# Altium schematic sheet PowerManagement.SchDoc
size A4; Author: Ben Bowden, Jesse Mocilac, Tayla Bender, Rothon Browne; CompanyName: James Cook University; DrawnBy1: Ben Bowden, Jesse Mocilac, Tayla Bender, Rothon Browne; Organization: James Cook University; Title1: CC3501 Baby Monitor; SheetNumber: 2; SheetTotal: 4; ProjectName: *ProjectName
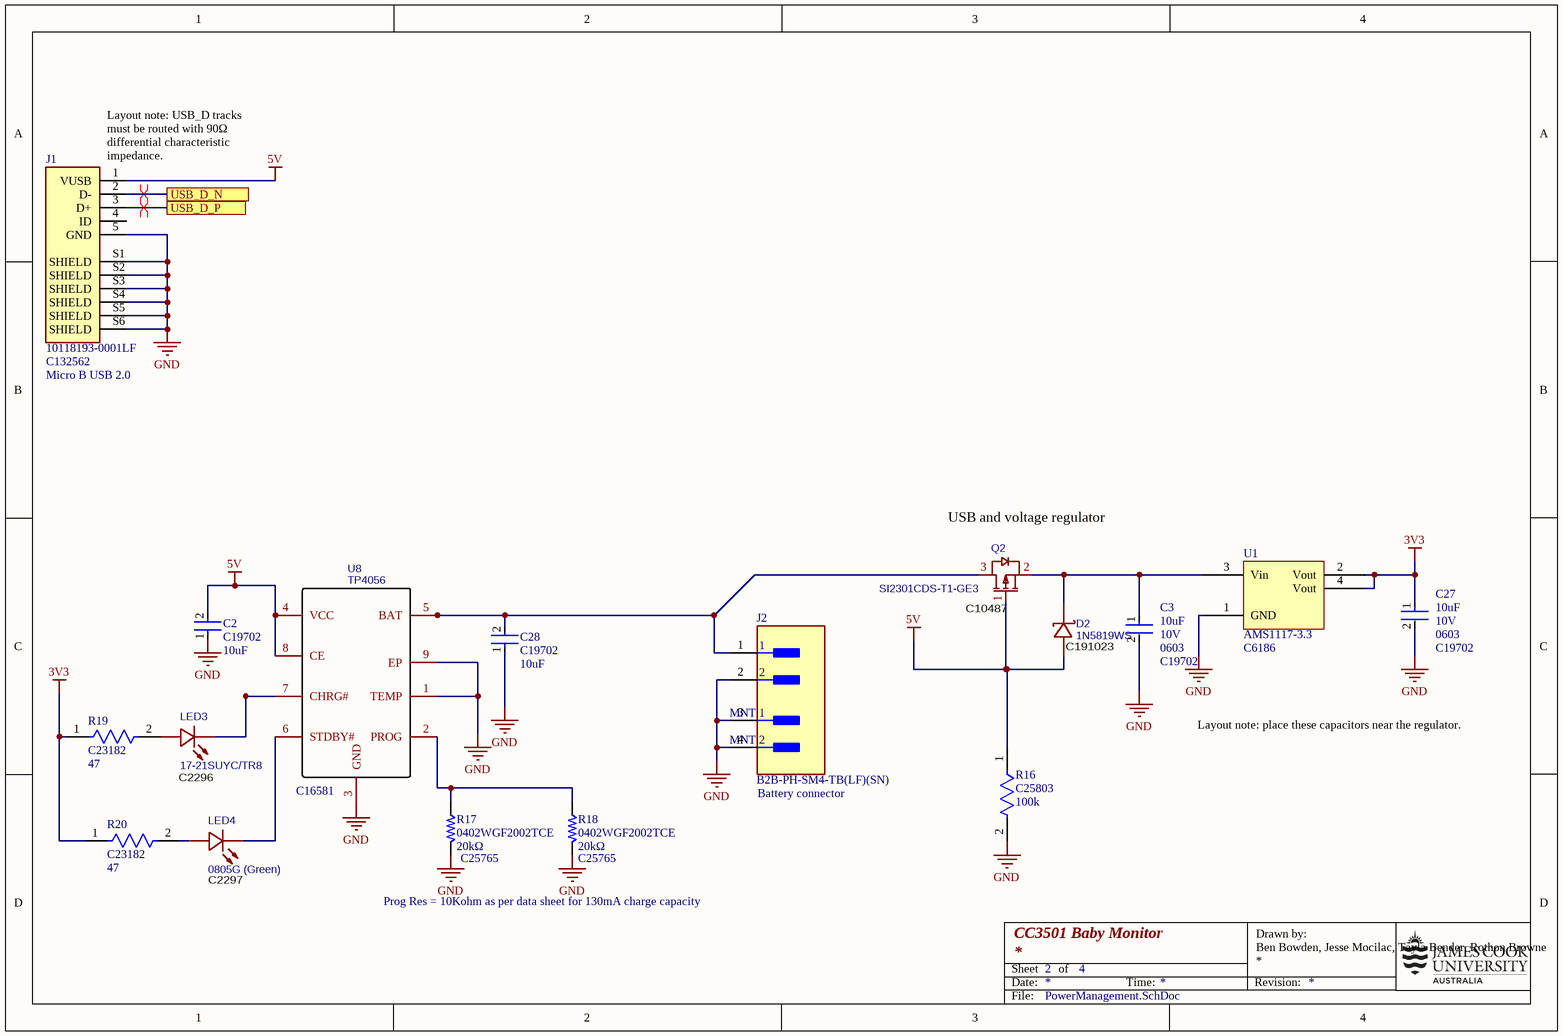
[diagram p0: PowerManagement.SchDoc]

## Parts
C2  JLCPCB Part: C19702  Capacitance: 10uF  [FP-CL10-IPC_B]  (hidden comment: CL10A106KP8NNNC)
C3  Voltage Rating: 10V  Case Code (Imperial): 0603  JLCPCB Part: C19702  Capacitance: 10uF  [FP-CL10-IPC_B]  (hidden comment: CL10A106KP8NNNC)
C27  Voltage Rating: 10V  Case Code (Imperial): 0603  JLCPCB Part: C19702  Capacitance: 10uF  [FP-CL10-IPC_B]  (hidden comment: CL10A106KP8NNNC)
C28  JLCPCB Part: C19702  Capacitance: 10uF  [FP-CL10-IPC_B]  (hidden comment: CL10A106KP8NNNC)
D2  1N5819WS  Supplier Part: C191023  [SOD-323_L1.8-W1.3-LS2.5-RD]
J1  10118193-0001LF  JLCPCB Part: C132562  [FCI_10118193-0001LF]
J2  B2B-PH-SM4-TB(LF)(SN)  [FP-B2B-PH-SM4-TB_LF_SN-MFG]
LED3  17-21SUYC/TR8  Supplier Part: C2296  [LED0805-R-RD]
LED4  0805G (Green)  Supplier Part: C2297  [LED0805-R-RD]
Q2  SI2301CDS-T1-GE3  Supplier Part: C10487  [SOT-23-3_L3.0-W1.7-P0.95-LS2.9-BR]
R16  JLCPCB Part: C25803  Resistance: 100k  [FP-CRCW0603-e3-IPC_B]  (hidden comment: 0603WAF1003T5E)
R17  0402WGF2002TCE  Resistance: 20kΩ  JLCPCB Part Number: C25765  [RES-0402]
R18  0402WGF2002TCE  Resistance: 20kΩ  JLCPCB Part Number: C25765  [RES-0402]
R19  JLCPCB Part: C23182  Resistance: 47  [FP-CRCW0603-e3-IPC_B]  (hidden comment: 0603WAF1003T5E)
R20  JLCPCB Part: C23182  Resistance: 47  [FP-CRCW0603-e3-IPC_B]  (hidden comment: 0603WAF1003T5E)
U1  AMS1117-3.3  JLCPCB Part: C6186  [SOT230P700X180-4N]
U8  TP4056  JLCPCB Part: C16581  [ESOP-8_L4.9-W3.9-P1.27-LS6.0-BL-EP]

## Ports
USB_D_N, USB_D_P

## Nets
3V3: C27.1 R19.1 R20.1 U1.2(Vout) U1.4(Vout)
5V: C2.2 D2.2(A) J1.1(VUSB) Q2.1(G) R16.1 U8.4(VCC) U8.8(CE)
GND: C2.1 C3.2 C27.2 C28.1 J1.5(GND) J1.S1(SHIELD) J1.S2(SHIELD) J1.S3(SHIELD) J1.S4(SHIELD) J1.S5(SHIELD) J1.S6(SHIELD) J2.2 J2.3(MNT_1) J2.4(MNT_2) R16.2 R17.2 R18.2 U1.1(GND) U8.1(TEMP) U8.3(GND) U8.9(EP)
USB_D_N: J1.2(D-) ; port USB_D_N
USB_D_P: J1.3(D+) ; port USB_D_P
NetC3_1: C3.1 D2.1(K) Q2.2(S) U1.3(Vin)
NetC28_2: C28.2 J2.1 Q2.3(D) U8.5(BAT)
NetLED3_1: LED3.1(+) R19.2
NetLED3_2: LED3.2(-) U8.7(CHRG#)
NetLED4_1: LED4.1(A) R20.2
NetLED4_2: LED4.2(K) U8.6(STDBY#)
NetR17_1: R17.1 R18.1 U8.2(PROG)

Not connected (* = marked no-connect by the designer): J1 4(ID)

## Layout directives
differential pair: USB_D_N, USB_D_P

## Notes on the sheet
- (near J1) Layout note: USB_D tracks must be routed with 90Ω differential characteristic impedance.
- (near J1) Micro B USB 2.0
- (near Q2) USB and voltage regulator
- Layout note: place these capacitors near the regulator.
- (near J2) Battery connector
- Prog Res = 10Kohm as per data sheet for 130mA charge capacity
- Date:
- Sheet
- of
- Time:
- Revision:
- Drawn by:
- File:

## Library data of the parts
C2 C3 C27 C28 = CMP-00006-4: Cap Ceramic 10uF 10V X5R ±10% Pad SMD 0603 +85°C T/R; Case Code (Metric): 1608; Packaging: Tape and Reel; Case/Package: 0603; Mount: Surface Mount; Max Operating Temperature: 85°C; Width: 0.031inch; Length: 0.063inch; Thickness: 0.041inch; Tolerance: 10%; Min Operating Temperature: -55°C
  C2 C28: Voltage Rating: 10V; Case Code (Imperial): 0603
D2 = 1N5819WS: Manufacturer: Hottech(合科泰); Contributor: LCSC; Supplier: LCSC; Manufacturer Part: 1N5819WS; JLCPCB Part Class: Basic Part; spicePre: D; spiceSymbolName: 1N5819WS
J1 = CMP-045-000000-7: USB - micro B USB 2.0 Receptacle Connector 5 Position Surface Mount, Right Angle; Through Hole; MF: Amphenol ICC; Pin Count: 11; Package: None; MP: 10118193-0001LF; SnapEDA_Link: https://www.snapeda.com/parts/10118193-0001LF/Amphenol%20FCI/view-part/2758989/?ref=snap; Design Item ID: 10118193-0001LF; Source: SnapEDAsch.SchLib; Component Type: Standard
J2 = CMP-2000-05163-2: CONN HEADER SMD 2POS 2MM; Number of Poles: 2; Max Current Rating: 2A; Gender: Male; Working Voltage: 100V; Mated Stacking Heights: 8.6mm; Contact Resistance: 20mR; Insulation Resistance: 1GR; Number of Contacts: 2; Housing Material: Polyamide; Lead Pitch: 2mm; Packaging: Tape and Reel; Fastening Type: Detent; Contact Finish - Mating: TIN; Width: 5.5mm; Min Operating Temperature: -25°C; Mount: Surface Mount; Current Rating: 2A; Pitch: 2mm; REACH SVHC: No SVHC; Flammability Rating: UL94 V-0; Contact Plating: Tin; Voltage Rating (AC): 100V; Length: 7.95mm; Number of Rows: 1; Max Operating Temperature: 85°C; Connector Type: Header; Height: 9.4mm; Insulation Material: Nylon; Depth: 5mm; Color: White; Termination: Solder; Housing Color: Beige; Contact Mating Length: 0.13inch; Contact Material: Copper Alloy; Orientation: Straight; Contact Type: Male Pin; Lead Free: Lead Free; Voltage Rating: 100V; Series: PH; Number of Positions: 2; Contact Shape: Square; Max Voltage Rating (AC): 100V; Insulation Color: Natural
LED3 = 17-21SUYC/TR8: Manufacturer: KENTO; Manufacturer Part: KT-0805黄灯; Supplier: LCSC; JLCPCB Part Class: Basic Part; spicePre: L; spiceSymbolName: 17-21SUYC/TR8
LED4 = 0805G (Green): Manufacturer: KENTO; Manufacturer Part: KT-0805G; Supplier: LCSC; JLCPCB Part Class: Basic Part; spicePre: L; spiceSymbolName: 0805G (Green)
Q2 = SI2301CDS-T1-GE3: Manufacturer: VISHAY(威世); Supplier: LCSC; Manufacturer Part: SI2301CDS-T1-GE3; JLCPCB Part Class: Basic Part; spicePre: Q; spiceSymbolName: SI2301CDS-T1-GE3
R16 = CMP-009-0004-3: RES Thick Film, 100kΩ, 1%, 0.1W, 100ppm/°C, 0603; Power Rating: 100mW; Voltage Rating: 75V; Mount: Surface Mount; Number of Pins: 2; Depth: 0.85mm; Case/Package: 0603; Composition: Thick Film; Max Operating Temperature: 155°C; Case Code (Metric): 1608; Contact Plating: Tin; Temperature Coefficient: 100ppm/°C; Weight: 7.1E-05oz; Height: 0.45mm; Termination: SMD/SMT; Tolerance: 1%; Min Operating Temperature: -55°C; Lead Free: Lead Free; Voltage Rating (DC): 75V; Case Code (Imperial): 0603; Length: 1.55mm; Packaging: Tape and Reel; Package Quantity: 5000; Radiation Hardening: No; Width: 0.85mm; Military Standard: Not
R17 R18 = CMP-009-00024-1: Resistor, 20kΩ, ±1%, 62.5mW, 50V, ±100ppm/℃, -55℃~+155℃, SMD 0402; Manufacturer: Uniroyal; ComponentLink2Description: JLCPCB Part URL; Tolerance: ±1%; JLCPCB Basic Part: Yes; ComponentLink1Description: Datasheet; Temperature Rating: -55℃~+155℃; Voltage Rating: 50V; Design Item ID: 0402WGF2002TCE; Category: Resistors; Package Size: 0402; ComponentLink1URL: https://datasheet.lcsc.com/lcsc/2206010100_UNI-ROYAL-Uniroyal-Elec-0402WGF2002TCE_C25765.pdf; Source: jlcpcb_resistors_basic.schlib; ComponentLink2URL: https://jlcpcb.com/partdetail/C25765; Temperature Coefficient: ±100ppm/℃; Power Rating: 62.5mW; Manufacturer Part Number: 0402WGF2002TCE
R19 R20 = CMP-009-0004-3: RES Thick Film, 47Ω, 1%, 0.1W, 100ppm/°C, 0603; Power Rating: 100mW; Voltage Rating: 75V; Mount: Surface Mount; Number of Pins: 2; Depth: 0.85mm; Case/Package: 0603; Composition: Thick Film; Max Operating Temperature: 155°C; Case Code (Metric): 1608; Contact Plating: Tin; Temperature Coefficient: 100ppm/°C; Weight: 7.1E-05oz; Height: 0.45mm; Termination: SMD/SMT; Tolerance: 1%; Min Operating Temperature: -55°C; Lead Free: Lead Free; Voltage Rating (DC): 75V; Case Code (Imperial): 0603; Length: 1.55mm; Packaging: Tape and Reel; Package Quantity: 5000; Radiation Hardening: No; Width: 0.85mm; Military Standard: Not
U1 = CMP-00001-4: 3.3V 1A LOW DROPOUT VOLTAGE REGULATOR SOT-223; Dropout voltage: 1.3 V; Output voltage: 3.3 V; Output current: 1 A
U8 = TP4056: Manufacturer: TOPPOWER(南京拓微); Manufacturer Part: TP4056-42-ESOP8; Contributor: Guest; Supplier: LCSC; Supplier Part: C16581; JLCPCB Part Class: Extended Part; spicePre: U; spiceSymbolName: TP4056